# EAGLE board tactile (EAGLE 9.6.2), part 1 of 2
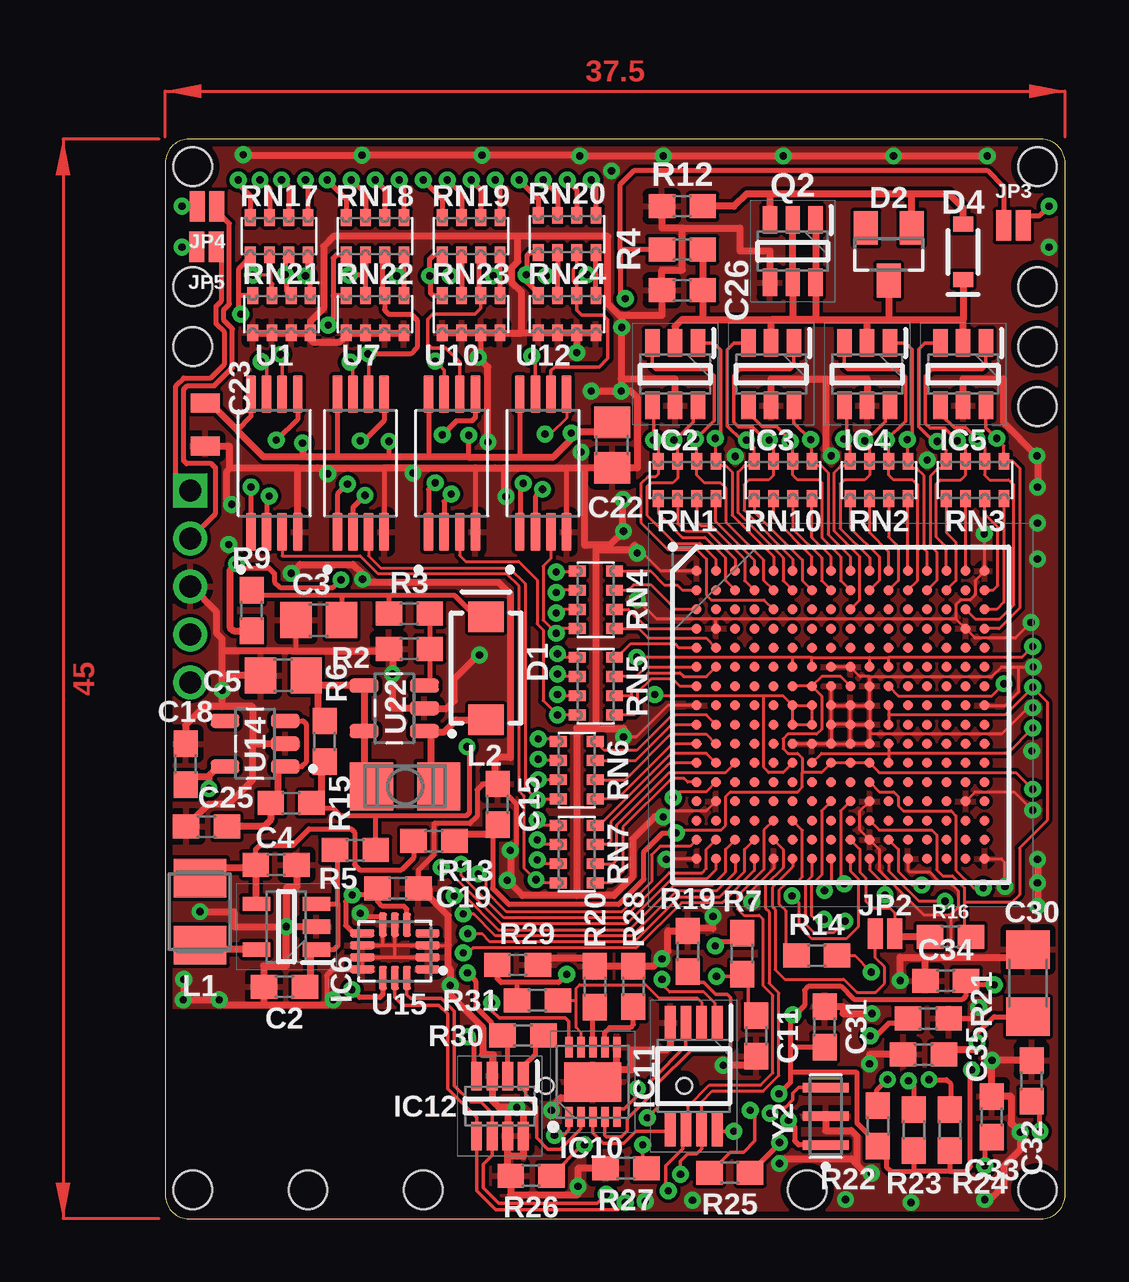
[diagram p5: board, top side]
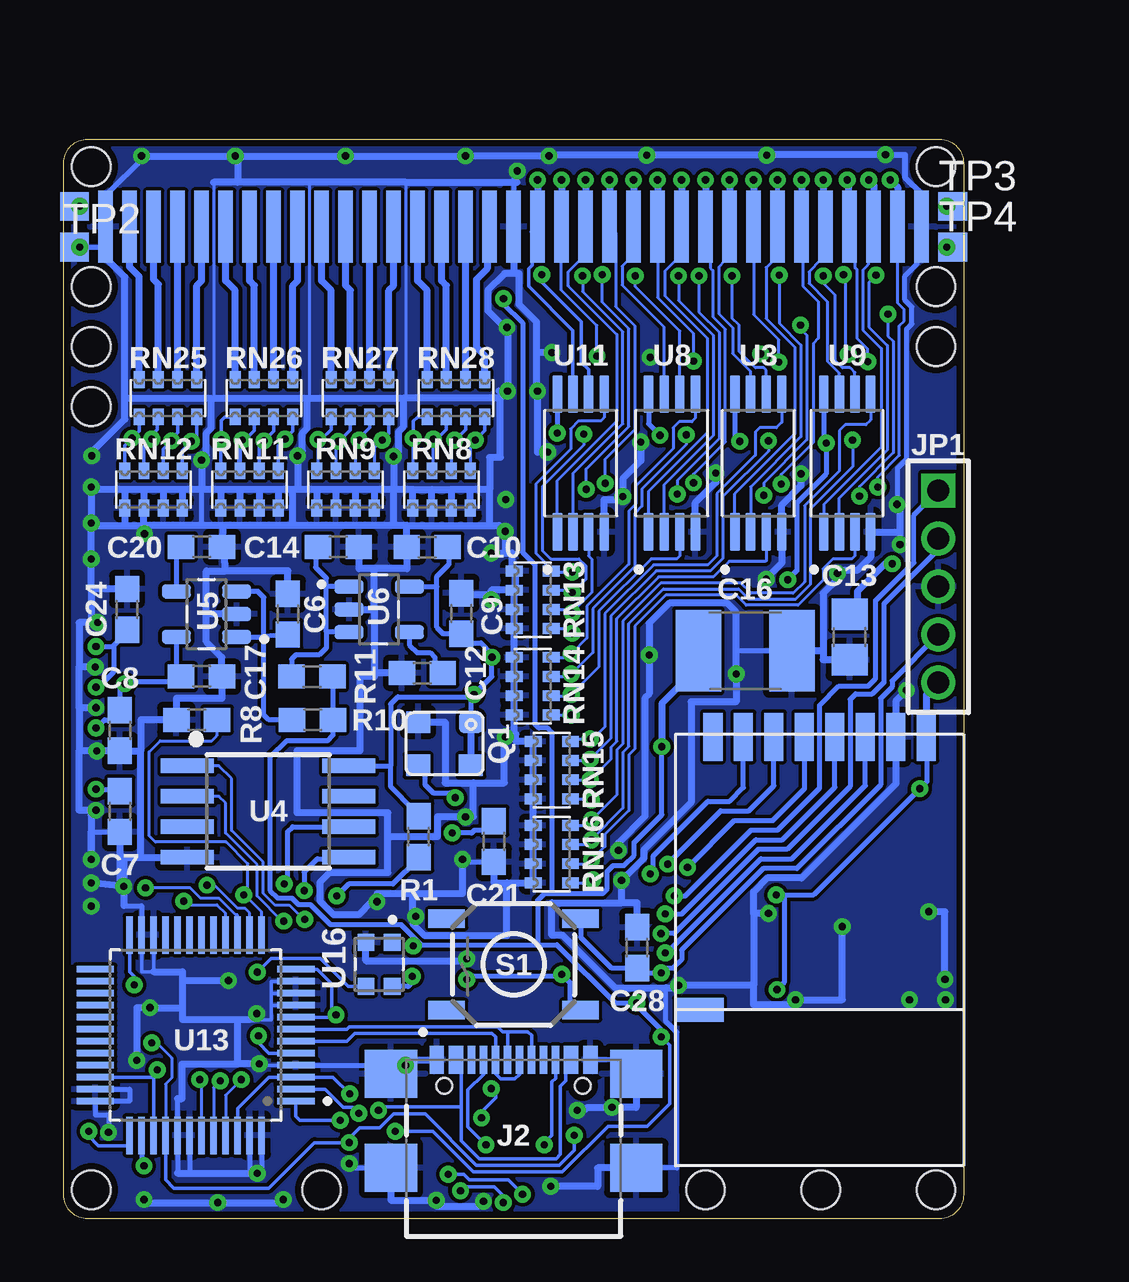
[diagram p6: board, bottom side, seen from below]

Size 37.5 x 45 mm. Coordinates in mm from the lower left corner, seen from the top.
Outline: 0,44 0,1 arc90 1,0 36.5,0 arc90 37.5,1 37.5,44 arc90 36.5,45 1,45 arc90 0,44
Copper layers (1*16): Top 0.035mm / dielectric 1.5mm / Bottom 0.035mm
Design rules "default *": minimum track width 0.125mm, minimum drill 0.3mm, track to track 0.125mm, track to pad 0.125mm, pad to pad 0.125mm, via to via 0.125mm, smd to smd 0mil, copper to edge 0.3mm, drill to drill 6mil, minimum pad ring 10mil, minimum via ring 0.2mm, stop-mask expansion 4mil, vias tented up to drill 0.4mm, thermal gap 10mil
Holes 1.6 mm at 36.35,43.85 1.15,43.85 1.15,38.85 36.35,38.85 36.35,1.2 26.75,1.2 1.15,36.35 36.35,36.35 10.75,1.2 1.15,1.2 36.35,33.85 5.95,1.2

## Footprints (pad centres in the part's own frame; a part is rotated, then mirrored left to right if it is on the bottom)
0603 = smd 1.1 x 1: 1 -0.85,0; 2 0.85,0
C0805 = smd 1.3 x 1.5: 1 -0.95,0; 2 0.95,0
C1812 = smd 1.9 x 3.4: 1 -1.95,0; 2 1.95,0
0805 = smd 0.8 x 1.2: 1 -0.9,0; 2 0.9,0
1206 = smd 1.6 x 1.8: 1 -1.4,0; 2 1.4,0
SMA-DIODE = smd 1.27 x 1.47: A -2.15,0; C 2.15,0
SOT23 = smd 1 x 1.4: 1 -0.95,-1.1; 2 0.95,-1.1; 3 0,1.1
SOD-323 = smd 0.63 x 0.83: A 1.15,0; C -1.15,0
BGA256C80P16X16_1400X1400X170 = smd 0.41 x 0.41: A1 -6,6; A2 -5.2,6; A3 -4.4,6; A4 -3.6,6; A5 -2.8,6; A6 -2,6; A7 -1.2,6; A8 -0.4,6; A9 0.4,6; A10 1.2,6; A11 2,6; A12 2.8,6; A13 3.6,6; A14 4.4,6; A15 5.2,6; A16 6,6; B1 -6,5.2; B2 -5.2,5.2; B3 -4.4,5.2; B4 -3.6,5.2; B5 -2.8,5.2; B6 -2,5.2; B7 -1.2,5.2; B8 -0.4,5.2; B9 0.4,5.2; B10 1.2,5.2; B11 2,5.2; B12 2.8,5.2; B13 3.6,5.2; B14 4.4,5.2; B15 5.2,5.2; B16 6,5.2; C1 -6,4.4; C2 -5.2,4.4; C3 -4.4,4.4; C4 -3.6,4.4; C5 -2.8,4.4; C6 -2,4.4; C7 -1.2,4.4; C8 -0.4,4.4; C9 0.4,4.4; C10 1.2,4.4; C11 2,4.4; C12 2.8,4.4; C13 3.6,4.4; C14 4.4,4.4; C15 5.2,4.4; C16 6,4.4; D1 -6,3.6; D2 -5.2,3.6; D3 -4.4,3.6; D4 -3.6,3.6; D5 -2.8,3.6; D6 -2,3.6; D7 -1.2,3.6; D8 -0.4,3.6; D9 0.4,3.6; D10 1.2,3.6; D11 2,3.6; D12 2.8,3.6; D13 3.6,3.6; D14 4.4,3.6; D15 5.2,3.6; D16 6,3.6; E1 -6,2.8; E2 -5.2,2.8; E3 -4.4,2.8; E4 -3.6,2.8; E5 -2.8,2.8; E6 -2,2.8; E7 -1.2,2.8; E8 -0.4,2.8; E9 0.4,2.8; E10 1.2,2.8; E11 2,2.8; E12 2.8,2.8; E13 3.6,2.8; E14 4.4,2.8; E15 5.2,2.8; E16 6,2.8; F1 -6,2; F2 -5.2,2; F3 -4.4,2; F4 -3.6,2; F5 -2.8,2; F6 -2,2; F7 -1.2,2; F8 -0.4,2; F9 0.4,2; F10 1.2,2; F11 2,2; F12 2.8,2; F13 3.6,2; F14 4.4,2; F15 5.2,2; F16 6,2; G1 -6,1.2; G2 -5.2,1.2; G3 -4.4,1.2; G4 -3.6,1.2; G5 -2.8,1.2; G6 -2,1.2; G7 -1.2,1.2; G8 -0.4,1.2; G9 0.4,1.2; G10 1.2,1.2; G11 2,1.2; G12 2.8,1.2; G13 3.6,1.2; G14 4.4,1.2; G15 5.2,1.2; G16 6,1.2; H1 -6,0.4; H2 -5.2,0.4; H3 -4.4,0.4; H4 -3.6,0.4; H5 -2.8,0.4; H6 -2,0.4; H7 -1.2,0.4; H8 -0.4,0.4; H9 0.4,0.4; H10 1.2,0.4; H11 2,0.4; H12 2.8,0.4; H13 3.6,0.4; H14 4.4,0.4; H15 5.2,0.4; H16 6,0.4; J1 -6,-0.4; J2 -5.2,-0.4; J3 -4.4,-0.4; J4 -3.6,-0.4; J5 -2.8,-0.4; J6 -2,-0.4; J7 -1.2,-0.4; J8 -0.4,-0.4; J9 0.4,-0.4; J10 1.2,-0.4; J11 2,-0.4; J12 2.8,-0.4; J13 3.6,-0.4; J14 4.4,-0.4; J15 5.2,-0.4; J16 6,-0.4; K1 -6,-1.2; K2 -5.2,-1.2; K3 -4.4,-1.2; K4 -3.6,-1.2; K5 -2.8,-1.2; K6 -2,-1.2; K7 -1.2,-1.2; K8 -0.4,-1.2; K9 0.4,-1.2; K10 1.2,-1.2; K11 2,-1.2; K12 2.8,-1.2; K13 3.6,-1.2; K14 4.4,-1.2; K15 5.2,-1.2; K16 6,-1.2; L1 -6,-2; L2 -5.2,-2; L3 -4.4,-2; L4 -3.6,-2; L5 -2.8,-2; L6 -2,-2; L7 -1.2,-2; L8 -0.4,-2; L9 0.4,-2; L10 1.2,-2; L11 2,-2; L12 2.8,-2; L13 3.6,-2; L14 4.4,-2; L15 5.2,-2; L16 6,-2; M1 -6,-2.8; M2 -5.2,-2.8; M3 -4.4,-2.8; M4 -3.6,-2.8; M5 -2.8,-2.8; M6 -2,-2.8; M7 -1.2,-2.8; M8 -0.4,-2.8; M9 0.4,-2.8; M10 1.2,-2.8; M11 2,-2.8; M12 2.8,-2.8; M13 3.6,-2.8; M14 4.4,-2.8; M15 5.2,-2.8; M16 6,-2.8; N1 -6,-3.6; N2 -5.2,-3.6; N3 -4.4,-3.6; N4 -3.6,-3.6; N5 -2.8,-3.6; N6 -2,-3.6; N7 -1.2,-3.6; N8 -0.4,-3.6; N9 0.4,-3.6; N10 1.2,-3.6; N11 2,-3.6; N12 2.8,-3.6; N13 3.6,-3.6; N14 4.4,-3.6; N15 5.2,-3.6; N16 6,-3.6; P1 -6,-4.4; P2 -5.2,-4.4; P3 -4.4,-4.4; P4 -3.6,-4.4; P5 -2.8,-4.4; P6 -2,-4.4; P7 -1.2,-4.4; P8 -0.4,-4.4; P9 0.4,-4.4; P10 1.2,-4.4; P11 2,-4.4; P12 2.8,-4.4; P13 3.6,-4.4; P14 4.4,-4.4; P15 5.2,-4.4; P16 6,-4.4; R1 -6,-5.2; R2 -5.2,-5.2; R3 -4.4,-5.2; R4 -3.6,-5.2; R5 -2.8,-5.2; R6 -2,-5.2; R7 -1.2,-5.2; R8 -0.4,-5.2; R9 0.4,-5.2; R10 1.2,-5.2; R11 2,-5.2; R12 2.8,-5.2; R13 3.6,-5.2; R14 4.4,-5.2; R15 5.2,-5.2; R16 6,-5.2; T1 -6,-6; T2 -5.2,-6; T3 -4.4,-6; T4 -3.6,-6; T5 -2.8,-6; T6 -2,-6; T7 -1.2,-6; T8 -0.4,-6; T9 0.4,-6; T10 1.2,-6; T11 2,-6; T12 2.8,-6; T13 3.6,-6; T14 4.4,-6; T15 5.2,-6; T16 6,-6
SOT95P280X145-6N = smd 1.15 x 0.6: 1 -1.3,0.95; 2 -1.3,0; 3 -1.3,-0.95; 4 1.3,-0.95; 5 1.3,0; 6 1.3,0.95
SOT95P280X145-5N = smd 1.15 x 0.6: 1 -1.25,0.95; 2 -1.25,0; 3 -1.25,-0.95; 4 1.25,-0.95; 5 1.25,0.95
SON50P300X300X90-11N = smd 0.85 x 0.3: 1 -1.45,1; 2 -1.45,0.5; 3 -1.45,0; 4 -1.45,-0.5; 5 -1.45,-1; 6 1.45,-1; 7 1.45,-0.5; 8 1.45,0; 9 1.45,0.5; 10 1.45,1 | smd 1.64 x 2.38: 11 0,0
SOP65P490X110-8N = smd 1.425 x 0.45: 1 -2.212,0.975; 2 -2.212,0.325; 3 -2.212,-0.325; 4 -2.212,-0.975; 5 2.212,-0.975; 6 2.212,-0.325; 7 2.212,0.325; 8 2.212,0.975
SOT65P280X145-8N = smd 1.2 x 0.45: 1 -1.25,0.975; 2 -1.25,0.325; 3 -1.25,-0.325; 4 -1.25,-0.975; 5 1.25,-0.975; 6 1.25,-0.325; 7 1.25,0.325; 8 1.25,0.975
GCT_USB4110-GF-A_REVB = smd 0.6 x 1.15: A1/B12 -3.2,1.075; A4/B9 -2.4,1.075; B1/A12 3.2,1.075; B4/A9 2.4,1.075 | smd 0.3 x 1.15: A5 -1.25,1.075; A6 -0.25,1.075; A7 0.25,1.075; A8 1.25,1.075; B5 1.75,1.075; B6 0.75,1.075; B7 -0.75,1.075; B8 -1.75,1.075 | smd 2.18 x 2: S1 -5.11,0.5; S2 5.11,0.5; S3 -5.11,-3.43; S4 5.11,-3.43 | hole 0.65: -2.89,0; 2.89,0
1X05M = drill 0.914 square: 1 -4,0 | drill 0.914: 2 -2,0; 3 0,0; 4 2,0; 5 4,0
SMT-JUMPER_2_NO_NO-SILK = smd 0.635 x 1.27: 1 -0.406,0; 2 0.406,0
L3230M = smd 1.6 x 2.2: 1 -1.4,0; 2 1.4,0
L3225P = smd 1.8 x 2: 1 -1.4,0; 2 1.4,0
XO32 = smd 1 x 0.9: P$1 -1.1,-0.9; P$2 1.1,-0.9; P$3 1.1,0.9; P$4 -1.1,0.9
EXBV8V = smd 0.45 x 0.7: 1 -1.2,-0.775; 2 -0.4,-0.775; 3 0.4,-0.775; 4 1.2,-0.775; 5 1.2,0.775; 6 0.4,0.775; 7 -0.4,0.775; 8 -1.2,0.775
TACTILE_SWITCH_SMD_5.2MM = smd 1.524 x 0.762: 1 -2.794,1.905; 2 2.794,1.905; 3 -2.794,-1.905; 4 2.794,-1.905
TP12SQ = smd 1.2 x 1.2: TP 0,0
SOP65P640X120-8N = smd 1.57 x 0.41: 1 -2.87,0.975; 2 -2.87,0.325; 3 -2.87,-0.325; 4 -2.87,-0.975; 5 2.87,-0.975; 6 2.87,-0.325; 7 2.87,0.325; 8 2.87,0.975
SO08-EIAJ = smd 0.61 x 2.21: 1 -1.905,-3.378; 2 -0.635,-3.378; 3 0.635,-3.378; 4 1.905,-3.378; 5 1.905,3.353; 6 0.635,3.353; 7 -0.635,3.353; 8 -1.905,3.353
SOT95P280X145-5N' = smd 1.21 x 0.59: 1 -1.255,0.95; 2 -1.255,0; 3 -1.255,-0.95; 4 1.255,-0.95; 5 1.255,0.95
QFP50P900X900X160-48N = smd 1.56 x 0.28: 1 -4.18,2.75; 2 -4.18,2.25; 3 -4.18,1.75; 4 -4.18,1.25; 5 -4.18,0.75; 6 -4.18,0.25; 7 -4.18,-0.25; 8 -4.18,-0.75; 9 -4.18,-1.25; 10 -4.18,-1.75; 11 -4.18,-2.25; 12 -4.18,-2.75; 25 4.18,-2.75; 26 4.18,-2.25; 27 4.18,-1.75; 28 4.18,-1.25; 29 4.18,-0.75; 30 4.18,-0.25; 31 4.18,0.25; 32 4.18,0.75; 33 4.18,1.25; 34 4.18,1.75; 35 4.18,2.25; 36 4.18,2.75 | smd 0.28 x 1.56: 13 -2.75,-4.18; 14 -2.25,-4.18; 15 -1.75,-4.18; 16 -1.25,-4.18; 17 -0.75,-4.18; 18 -0.25,-4.18; 19 0.25,-4.18; 20 0.75,-4.18; 21 1.25,-4.18; 22 1.75,-4.18; 23 2.25,-4.18; 24 2.75,-4.18; 37 2.75,4.18; 38 2.25,4.18; 39 1.75,4.18; 40 1.25,4.18; 41 0.75,4.18; 42 0.25,4.18; 43 -0.25,4.18; 44 -0.75,4.18; 45 -1.25,4.18; 46 -1.75,4.18; 47 -2.25,4.18; 48 -2.75,4.18
PQFN50P300X250X97-14N = smd 1.01 x 0.325: 1 -1.36,0.75; 2 -1.36,0.25; 3 -1.36,-0.25; 4 -1.36,-0.75; 8 1.36,-0.75; 9 1.36,-0.25; 10 1.36,0.25; 11 1.36,0.75 | smd 0.325 x 1.01: 5 -0.5,-1.11; 6 0,-1.11; 7 0.5,-1.11; 12 0.5,1.11; 13 0,1.11; 14 -0.5,1.11
LED_WS2812-2020 = smd 0.7 x 0.7: 1 0.915,-0.55; 2 0.915,0.55; 3 -0.915,0.55; 4 -0.915,-0.55
PAD3X05 = smd 0.6 x 3: P$1 0,0
NRF24SMT = smd 0.8 x 2: 3V3 -4.445,-8.89; CE -1.905,-8.89; CSN -0.635,-8.89; GND -3.175,-8.89; IRQ 4.445,-8.89; MISO 3.175,-8.89; MOSI 1.905,-8.89; SCK 0.635,-8.89 | smd 2 x 1: NC 5,2.5
OSC_CSTCE8M00G52A-R0 = smd 0.4 x 1.9: 1 -1.2,0; 2 0,0; 3 1.2,0

## Placement (x,y rotation side)
C2  1.0uF  [0603]  4.97,9.68 180 top
C3  [C0805]  6.4,24.95 180 top
C4  1.0uF  [0603]  4.62,14.75 0 top
C5  [C0805]  4.93,22.65 180 top
C6  1.0uF  [0603]  28.15,25.2 90 bottom
C7  1.0uF  [0603]  35.15,16.98 270 bottom
C8  1.0uF  [0603]  35.15,20.35 270 bottom
C9  1.0uF  [0603]  20.93,25.23 90 bottom
C10  1.0uF  [0603]  22.35,28 180 bottom
C11  1.0uF  [0603]  24.62,7.62 270 top
C12  1.0uF  [0603]  22.55,22.75 180 bottom
C13  [C0805]  4.75,24.25 270 bottom
C14  1.0uF  [0603]  26.05,28 0 bottom
C15  1.0uF  [0603]  13.85,17.27 90 top
C16  [C1812]  9.1,23.67 0 bottom
C17  1.0uF  [0603]  31.75,22.6 0 bottom
C18  1.0uF  [0603]  0.85,18.95 90 top
C19  1.0uF  [0603]  9.7,13.77 0 top
C20  1.0uF  [0603]  31.75,28 0 bottom
C21  1.0uF  [0603]  19.57,15.73 270 bottom
C22  [C0805]  18.62,32.25 270 top
C23  22uF  [0805]  1.67,33.1 270 top
C24  1.0uF  [0603]  34.85,25.4 90 bottom
C25  1.0uF  [0603]  1.72,16.35 180 top
C26  1.0uF  [0603]  21.55,38.7 180 top
C28  1.0uF  [0603]  13.6,11.3 90 bottom
C30  1.0uF  [1206]  35.95,9.82 90 top
C31  1.0uF  [0603]  27.48,8 90 top
C32  1.0uF  [0603]  36.1,5.75 90 top
C33  1.0uF  [0603]  34.45,4.25 90 top
C34  1.0uF  [0603]  32.52,9.93 180 top
C35  1.0uF  [0603]  31.6,6.85 180 top
D1  1A/40V/500mV  [SMA-DIODE]  13.38,22.95 90 top
D2  [SOT23]  30.15,40.2 180 top
D4  3.6V  [SOD-323]  33.25,40.3 90 top
IC1  LFE5U-12F-6BG256C  [BGA256C80P16X16_1400X1400X170]  28.15,21 0 top
IC2  DALC208SC6  [SOT95P280X145-6N]  21.25,35.2 270 top
IC3  DALC208SC6  [SOT95P280X145-6N]  25.25,35.2 270 top
IC4  DALC208SC6  [SOT95P280X145-6N]  29.25,35.2 270 top
IC5  DALC208SC6  [SOT95P280X145-6N]  33.25,35.2 270 top
IC6  SC189CSKTRT  [SOT95P280X145-5N]  5.05,12.18 180 top
IC10  ISL9301IRZ  [SON50P300X300X90-11N]  17.82,5.7 90 top
IC11  PCA9536DP,118  [SOP65P490X110-8N]  22.02,5.95 270 top
IC12  INA219AIDCNT  [SOT65P280X145-8N]  13.95,4.7 270 top
J2  USB4110-GF-A_REVB  [GCT_USB4110-GF-A_REVB]  18.75,5.55 0 bottom
JP1  [1X05M]  1.05,26.35 270 bottom
JP2  JUMPER-SMT_2_NO_NO-SILK  [SMT-JUMPER_2_NO_NO-SILK]  30,11.88 0 top
JP3  JUMPER-SMT_2_NO_NO-SILK  [SMT-JUMPER_2_NO_NO-SILK]  35.35,41.4 0 top
JP4  JUMPER-SMT_2_NO_NO-SILK  [SMT-JUMPER_2_NO_NO-SILK]  1.75,42.2 180 top
JP5  JUMPER-SMT_2_NO_NO-SILK  [SMT-JUMPER_2_NO_NO-SILK]  1.72,40.5 180 top
L1  [L3230M]  1.45,12.8 270 top
L2  [L3225P]  10,18.02 0 top
Q1  CRYSTALRESONATORXO32  [XO32]  21.62,19.8 180 bottom
Q2  IRLTS6342TRPBF  [SOT95P280X145-6N]  26.15,40.33 270 top
R1  1k  [0603]  22.7,15.93 90 bottom
R2  1k  [0603]  10.18,23.75 0 top
R3  1k  [0603]  10.18,25.23 180 top
R4  1k  [0603]  21.55,40.4 180 top
R5  0  [0603]  7.93,15.38 180 top
R6  0  [0603]  6.65,19.9 90 top
R7  [0603]  24.05,11.05 90 top
R8  1k  [0603]  31.95,20.8 0 bottom
R9  0  [0603]  3.6,25.35 90 top
R10  0  [0603]  27.12,20.8 180 bottom
R11  0  [0603]  27.15,22.6 180 bottom
R12  1k  [0603]  21.55,42.2 0 top
R13  0  [0603]  11.2,15.75 180 top
R14  [0603]  27.15,10.98 180 top
R15  0  [0603]  5.25,17.32 180 top
R16  1k  [0603]  32.73,11.75 0 top
R19  [0603]  21.77,11.15 270 top
R20  [0603]  17.9,9.68 270 top
R21  [0603]  31.8,8.35 180 top
R22  [0603]  29.7,3.88 270 top
R23  [0603]  31.2,3.7 270 top
R24  [0603]  32.7,3.7 270 top
R25  [0603]  23.52,1.93 0 top
R26  [0603]  15.25,1.8 180 top
R27  [0603]  19.2,2.1 0 top
R28  [0603]  19.51,9.69 270 top
R29  [0603]  14.69,10.59 180 top
R30  [0603]  14.91,7.64 0 top
R31  [0603]  15.51,9.11 180 top
RN1  [EXBV8V]  21.75,30.8 180 top
RN2  [EXBV8V]  29.75,30.8 180 top
RN3  [EXBV8V]  33.75,30.8 180 top
RN4  [EXBV8V]  17.95,25.8 90 top
RN5  [EXBV8V]  17.95,22.2 90 top
RN6  [EXBV8V]  17.15,18.7 90 top
RN7  [EXBV8V]  17.15,15.2 90 top
RN8  [EXBV8V]  21.75,30.4 180 bottom
RN9  [EXBV8V]  25.75,30.4 180 bottom
RN10  [EXBV8V]  25.75,30.8 180 top
RN11  [EXBV8V]  29.75,30.4 180 bottom
RN12  [EXBV8V]  33.75,30.4 180 bottom
RN13  [EXBV8V]  17.95,25.8 270 bottom
RN14  [EXBV8V]  17.95,22.2 270 bottom
RN15  [EXBV8V]  17.15,18.7 270 bottom
RN16  [EXBV8V]  17.15,15.2 270 bottom
RN17  [EXBV8V]  4.75,40.95 0 top
RN18  [EXBV8V]  8.75,40.95 0 top
RN19  [EXBV8V]  12.75,40.95 0 top
RN20  [EXBV8V]  16.75,41.05 0 top
RN21  [EXBV8V]  4.85,37.7 180 top
RN22  [EXBV8V]  8.75,37.7 180 top
RN23  [EXBV8V]  12.75,37.7 180 top
RN24  [EXBV8V]  16.75,37.7 180 top
RN25  [EXBV8V]  33.15,34.2 0 bottom
RN26  [EXBV8V]  29.15,34.2 0 bottom
RN27  [EXBV8V]  25.15,34.2 0 bottom
RN28  [EXBV8V]  21.15,34.2 0 bottom
S1  [TACTILE_SWITCH_SMD_5.2MM]  18.75,10.6 180 bottom
TP1  TPTP12SQ  [TP12SQ]  37.05,42.2 0 bottom
TP2  TPTP12SQ  [TP12SQ]  37.05,40.5 0 bottom
TP3  TPTP12SQ  [TP12SQ]  0.45,42.2 0 bottom
TP4  TPTP12SQ  [TP12SQ]  0.45,40.5 0 bottom
U1  LM358PW  [SOP65P640X120-8N]  4.55,31.5 90 top
U3  LM358PW  [SOP65P640X120-8N]  8.55,31.5 90 bottom
U4  25F32006WSOI  [SO08-EIAJ]  28.96,16.98 270 bottom
U5  LP2985AIM5-2.5  [SOT95P280X145-5N']  31.55,25.2 180 bottom
U6  LP2985AIM5-2.5  [SOT95P280X145-5N']  24.35,25.4 0 bottom
U7  LM358PW  [SOP65P640X120-8N]  8.15,31.5 90 top
U8  LM358PW  [SOP65P640X120-8N]  12.15,31.5 90 bottom
U9  LM358PW  [SOP65P640X120-8N]  4.85,31.5 90 bottom
U10  LM358PW  [SOP65P640X120-8N]  11.95,31.5 90 top
U11  LM358PW  [SOP65P640X120-8N]  15.95,31.5 90 bottom
U12  LM358PW  [SOP65P640X120-8N]  15.75,31.5 90 top
U13  FT232HL-REEL  [QFP50P900X900X160-48N]  32,7.65 180 bottom
U14  LP2985AIM5-2.5  [SOT95P280X145-5N']  3.75,19.8 180 top
U15  ICM-42605  [PQFN50P300X250X97-14N]  9.57,11.15 180 top
U16  WS2812-2020  [LED_WS2812-2020]  24.35,10.6 90 bottom
U22  LM2735XMF  [SOT95P280X145-5N']  9.55,21.27 180 top
U$1  PADPAD3X05  [PAD3X05]  18.75,41.35 0 bottom
U$2  PADPAD3X05  [PAD3X05]  19.75,41.35 0 bottom
U$3  PADPAD3X05  [PAD3X05]  20.75,41.35 0 bottom
U$4  PADPAD3X05  [PAD3X05]  21.75,41.35 0 bottom
U$5  PADPAD3X05  [PAD3X05]  22.75,41.35 0 bottom
U$6  PADPAD3X05  [PAD3X05]  23.75,41.35 0 bottom
U$7  PADPAD3X05  [PAD3X05]  24.75,41.35 0 bottom
U$8  PADPAD3X05  [PAD3X05]  25.75,41.35 0 bottom
U$9  NRF24MODULE  [NRF24SMT]  6,11.2 180 bottom
U$10  PADPAD3X05  [PAD3X05]  26.75,41.35 0 bottom
U$11  PADPAD3X05  [PAD3X05]  27.75,41.35 0 bottom
U$12  PADPAD3X05  [PAD3X05]  28.75,41.35 0 bottom
U$13  PADPAD3X05  [PAD3X05]  29.75,41.35 0 bottom
U$14  PADPAD3X05  [PAD3X05]  30.75,41.35 0 bottom
U$15  PADPAD3X05  [PAD3X05]  31.75,41.35 0 bottom
U$16  PADPAD3X05  [PAD3X05]  32.75,41.35 0 bottom
U$17  PADPAD3X05  [PAD3X05]  33.75,41.35 0 bottom
U$18  PADPAD3X05  [PAD3X05]  34.75,41.35 0 bottom
U$19  PADPAD3X05  [PAD3X05]  4.75,41.35 0 bottom
U$20  PADPAD3X05  [PAD3X05]  2.75,41.35 0 bottom
U$21  PADPAD3X05  [PAD3X05]  3.75,41.35 0 bottom
U$22  PADPAD3X05  [PAD3X05]  5.75,41.35 0 bottom
U$23  PADPAD3X05  [PAD3X05]  6.75,41.35 0 bottom
U$24  PADPAD3X05  [PAD3X05]  7.75,41.35 0 bottom
U$25  PADPAD3X05  [PAD3X05]  8.75,41.35 0 bottom
U$26  PADPAD3X05  [PAD3X05]  9.75,41.35 0 bottom
U$27  PADPAD3X05  [PAD3X05]  10.75,41.35 0 bottom
U$28  PADPAD3X05  [PAD3X05]  11.75,41.35 0 bottom
U$29  PADPAD3X05  [PAD3X05]  12.75,41.35 0 bottom
U$30  PADPAD3X05  [PAD3X05]  13.75,41.35 0 bottom
U$31  PADPAD3X05  [PAD3X05]  14.75,41.35 0 bottom
U$32  PADPAD3X05  [PAD3X05]  15.75,41.35 0 bottom
U$33  PADPAD3X05  [PAD3X05]  16.75,41.35 0 bottom
U$34  PADPAD3X05  [PAD3X05]  17.75,41.35 0 bottom
U$35  PADPAD3X05  [PAD3X05]  1.75,41.35 0 bottom
U$36  PADPAD3X05  [PAD3X05]  35.75,41.35 0 bottom
Y2  CSTCE8M00G52A-R0  [OSC_CSTCE8M00G52A-R0]  27.52,4.27 90 top